# Altium schematic sheet Power_1.SchDoc
size A4
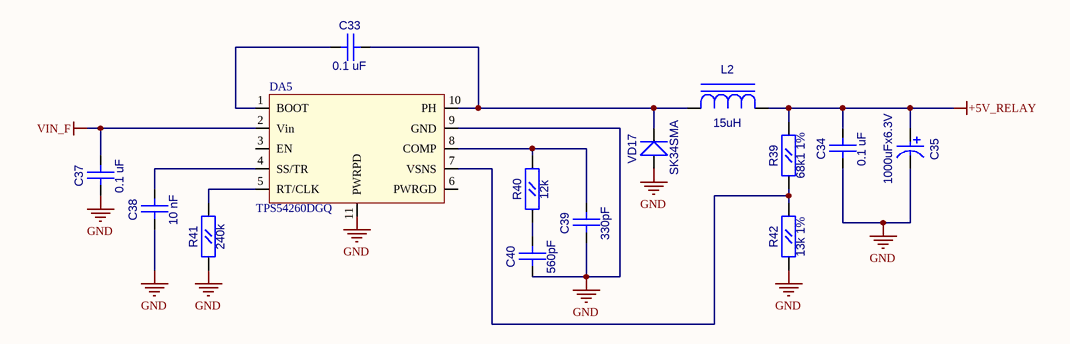
[diagram p0: Power_1.SchDoc]

## Parts
C33  0.1 uF  [CC0603]
C34  0.1 uF  [CC0603]
C35  1000uFx6.3V  [CC8X3.5]
C37  0.1 uF  [CC0603]
C38  10 nF  [CC0603]
C39  330pF  [CC0603]
C40  560pF  [CC0603]
DA5  TPS54260DGQ  [S-PDSO-G10]
L2  15uH  [SDR0805]
R39  68k1 1%  [RC0603]
R40  12k  [RC0603]
R41  240k  [RC0603]
R42  13k 1%  [RC0603]
VD17  SK34SMA  [SMA]

## Nets
+5V_RELAY: C34.1(A) C35.1 L2.2(A) R39.2(B)
GND: C34.2(B) C35.2 C37.2(B) C38.2(B) C39.2(B) C40.2(B) DA5.9(GND) DA5.11(PWRPD) R41.1(A) R42.1(A) VD17.1(A)
VIN_F: C37.1(A) DA5.2(Vin)
NetC33_1: C33.1(A) DA5.10(PH) L2.1(C) VD17.2(K)
NetC33_2: C33.2(B) DA5.1(BOOT)
NetC38_1: C38.1(A) DA5.4(SS/TR)
NetC39_1: C39.1(A) DA5.8(COMP) R40.2(B)
NetC40_1: C40.1(A) R40.1(A)
NetDA5_5: DA5.5(RT/CLK) R41.2(B)
NetDA5_7: DA5.7(VSNS) R39.1(A) R42.2(B)

Not connected (* = marked no-connect by the designer): DA5 3(EN) 6(PWRGD)

## Library data of the parts
C33 C34 C37-C40 = CC0603
  C33 C34 C37: Value: 0.1 uF
  C38: Value: 10 nF
  C39: Value: 330pF
  C40: Value: 560pF
C35 = CAP0.35: Value: 1000uFx6.3V
L2 = SDR0805: Value: 15uH
R39-R42 = RC0603
  R39: Value: 68k1 1%
  R40: Value: 12k
  R41: Value: 240k
  R42: Value: 13k 1%
VD17 = SK34SMA: Schottky Rectifier; Value: {Value}